# EasyEDA Pro project 4090_Portable_Fan.epro, board PCB1_2
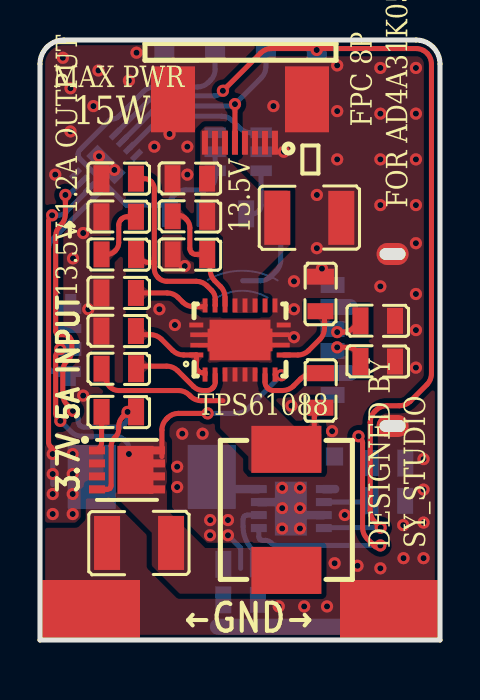
[diagram p8: board, top side]
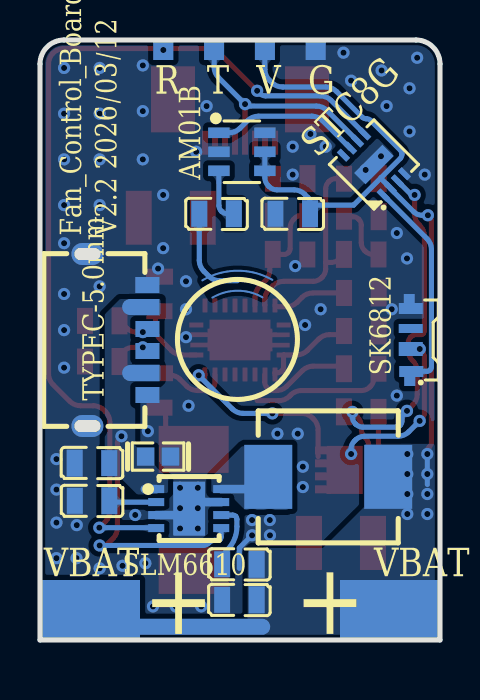
[diagram p9: board, bottom side, seen from below]

Outline 20 x 30 mm; copper layers: Top Layer, Bottom Layer. Coordinates in mm from the lower left corner of the outline.
Outline path: 0,28.8 arc(0.35,29.65) 1.2,30 18.8,30 arc(19.65,29.65) 20,28.8 20,0 0,0 0,28.8
Stack: Top Layer 0.035mm / Dielectric1 1.51mm FR4 er 4.5 / Bottom Layer 0.035mm

## Design rules (mm)
spacing copperThickness1oz (default): track to track 0.102, other pairs 0.152 to 0.3
spacing copperThickness2oz: track to track 0.203, other pairs 0.152 to 0.3
spacing Plane_innerPlane: track to track 0.102, other pairs 0.152 to 0.3
spacing Copper_copperRegion: track to track 0.102, other pairs 0.152 to 0.3
track width copperThickness1oz (default): min 0.127, default 0.254, max 2.54
track width copperThickness2oz: min 0.203, default 0.254, max 2.54
differential pair differentialPair (default): width min 0.127, default 0.254, max 2.54; gap min 0.152, default 0.152
net GND uses copperRegion_copperThickness1oz
net VBUS uses copperRegion_copperThickness1oz
net VPOWER uses copperRegion_copperThickness1oz
net VBAT uses copperRegion_copperThickness1oz
net 13.5V uses copperRegion_copperThickness1oz
net $1N43227 uses copperRegion_copperThickness1oz
net $1N43239 uses copperRegion_copperThickness1oz
pour e179 uses Copper_copperRegion, copperRegion_Copper_copperRegion
pour e222 uses Copper_copperRegion, copperRegion_Copper_copperRegion
pour e226 uses Copper_copperRegion, copperRegion_Copper_copperRegion

## Placement (name value [footprint] x y rotation side)
C1  100nF  [0805_S]  7.37 21.36 90 bottom
C2  22pF  [0805_S]  3.94 23.02 270 top
C3  330pF  [0805_S]  3.94 21.11 270 top
C4  2.2uF  [0805_S]  3.94 15.39 270 top
C5  100uF  [C1210]  4.95 4.85 0 top
C6  100nF  [0805_S]  13.97 12.47 180 top
C7  100uF  [C1210]  13.46 21.11 180 top
C8  22uF  [0805_S]  7.49 23.02 270 top
C9  22uF  [0805_S]  17.4 8.79 270 bottom
C10  22uF  [0805_S]  10.03 2.06 90 bottom
C11  100nF  [0805_S]  13.97 17.3 180 top
FPC1  AFC07-S08ECA-00  [FPC-SMD_P0.5-8P_LCS-SH-H2.0]  10 25.95 0 top
L1  2.2uh  [IND-SMD_L7.0-W6.6_MCW-0650-220]  12.32 6.5 90 top
L2  2.2uH  [IND-SMD_L7.0-W6.6]  5.59 8.16 180 bottom
LED1  SK6812SIDE-A  [LED-SMD_4P-L4.0-W1.6-L]  1.45 15 90 bottom
NOREF  -  [Pad_e184]  2.5 1.5 0 top
NOREF#2  -  [Pad_e85]  6.22 29.5 180 top
NOREF#3  -  [Pad_e88]  13.84 29.5 180 top
NOREF#4  -  [Pad_e86]  8.75 29.5 180 top
NOREF#5  -  [Pad_e189]  17.5 1.5 0 top
NOREF#6  -  [Pad_e185]  17.5 1.5 0 top
NOREF#7  -  [Pad_e87]  11.29 29.5 180 top
NOREF#8  -  [Pad_e186]  2.5 1.5 0 top
Q1  AON7421  [DFN-8_L3.0-W3.0-P0.65-BL]  4.35 8.51 270 top
R1  10K  [0805_S]  3.94 11.46 90 top
R2  10K  [0805_S]  11.18 21.36 90 bottom
R3  60.4K  [0805_S]  3.94 19.33 90 top
R4  866K  [0805_S]  7.49 21.24 90 top
R5  91K  [0805_S]  7.49 19.33 90 top
R6  169K  [0805_S]  3.94 13.62 90 top
R7  60.4K  [0805_S]  3.94 17.3 270 top
R8  240  [0805_S]  17.4 7.01 90 bottom
R9  5.1K  [0805_S]  16.89 15.9 270 top
R10  5.1K  [0805_S]  10.03 3.84 90 bottom
R11  5.1K  [0805_S]  16.89 13.87 270 top
TVS1  PESD0603-240  [D0603-BI]  14.1 9.17 0 bottom
U1  STC8G1K08A-36I-DFN8  [DFN-8_L3.0-W3.0-P0.50-BL-EP]  3.3 23.78 135 bottom
U2  -  [F9-10-6-0.4喇叭口无针触摸弹簧]  10 15 179.6 bottom
U3  TPS61088RHLR  [VQFN-20_L4.6-W3.6-P0.50-BL]  10 15 0 top
U4  -  [DFN-8_L3.0-W3.0-P0.65-BL-EP_AOZ6662DI]  12.89 6.92 180 bottom
U5  AM01B  [SOT-23-6_L2.9-W1.6-P0.95-LS2.8-BL]  9.91 24.41 270 bottom
USBC1  TYPE-C 6P WTL5.0 108  [USB-C-SMD_TYPE-C-6P-WTL5.0-108]  16.13 15 270 bottom

## Footprints (pads in the part's own frame, mm; a bottom-side part is the same pattern mirrored in y, then rotated)
0805_S
  rect 1.3x0.8 smd: 1(-0.052,0.86)
  rect 1.35x0.8 smd: 2(-0.052,-0.867)
C1210
  rect 1.3x2.7 smd: 1(-1.6,0) 2(1.6,0)
D0603-BI
  rect 0.873x0.907 smd: 1(-0.622,0) 2(0.622,0)
DFN-8_L3.0-W3.0-P0.50-BL-EP
  rect 0.28x0.665 smd: 1(-0.75,-1.407) 2(-0.25,-1.407) 3(0.25,-1.407) 4(0.75,-1.407) 5(0.75,1.407) 6(0.25,1.407) 7(-0.25,1.407) 8(-0.75,1.407)
  rect 2x0.8 smd: 9(0,0)
DFN-8_L3.0-W3.0-P0.65-BL
  rect 0.4x0.8 smd: 1(-0.975,-1.5) 2(-0.325,-1.5) 3(0.325,-1.5) 4(0.975,-1.5) 5(0.975,1.5) 6(0.325,1.5) 7(-0.325,1.5) 8(-0.975,1.5)
  rect 2.4x1.8 smd: 9(0,0.425)
DFN-8_L3.0-W3.0-P0.65-BL-EP_AOZ6662DI
  rect 0.8x0.4 smd: 1(-1.3,0.622) 2(-1.3,-0.028) 3(-1.3,-0.678) 4(-1.3,-1.328) 5(1.95,-1.328) 6(1.95,-0.678) 7(1.95,-0.028) 8(1.95,0.622)
  rect 1.6x2.7 smd: 9(0.347,-0.353)
F9-10-6-0.4喇叭口无针触摸弹簧
  custom 3.5x1.335 smd: 1(-0.111,2.965)
FPC-SMD_P0.5-8P_LCS-SH-H2.0
  rect 0.3x1.2 smd: 1(1.748,-1.084) 2(1.248,-1.084) 3(0.748,-1.084) 4(0.248,-1.084) 5(-0.252,-1.084) 6(-0.752,-1.084) 7(-1.252,-1.084) 8(-1.754,-1.083)
  rect 2.2x3.3 smd: 9(3.35,1.084) 10(-3.35,1.084)
IND-SMD_L7.0-W6.6
  rect 2.4x3.2 smd: 1(-3,0) 2(3,0)
IND-SMD_L7.0-W6.6_MCW-0650-220
  rect 2.35x3.5 smd: 1(-3.025,0) 2(3.025,0)
LED-SMD_4P-L4.0-W1.6-L
  custom 1x1.2 smd: 1(-1.8,-0.013) 4(1.8,0.013)
  custom 0.7x1.2 smd: 2(-0.45,0.013)
  custom 0.45x1.2 smd: 3(0.575,0.013)
Pad_e85
  rect 1x1 smd far side: 2(0,0)
Pad_e86
  rect 1x1 smd far side: 2(0,0)
Pad_e87
  rect 1x1 smd far side: 2(0,0)
Pad_e88
  rect 1x1 smd far side: 2(0,0)
Pad_e184
  rect 5x3 smd: 22(0,0)
Pad_e185
  rect 5x3 smd: 22(0,0)
Pad_e186
  rect 5x3 smd far side: 22(0,0)
Pad_e189
  rect 5x3 smd far side: 22(0,0)
SOT-23-6_L2.9-W1.6-P0.95-LS2.8-BL
  rect 0.532x1.072 smd: 1(-0.95,-1.149) 2(0,-1.149) 3(0.95,-1.149) 4(0.95,1.149) 5(0,1.149) 6(-0.95,1.149)
USB-C-SMD_TYPE-C-6P-WTL5.0-108
  oval 1.1x1.6 hole 0.6x1.3: 7(-4.3,-1.5) 8(4.3,-1.5)
  rect 0.8x1.2 smd: A5(-0.55,1.5) A9(1.65,1.5) A12(2.75,1.5) B5(0.55,1.5) B9(-1.65,1.5) B12(-2.75,1.5)
VQFN-20_L4.6-W3.6-P0.50-BL
  rect 0.7x0.244 smd: 1(-2.185,-0.75) 10(2.185,-0.75) 11(2.185,0.75) 20(-2.185,0.75)
  rect 0.244x0.7 smd: 2(-1.748,-1.727) 3(-1.248,-1.727) 4(-0.748,-1.727) 5(-0.248,-1.727) 6(0.252,-1.727) 7(0.752,-1.727) 8(1.252,-1.727) 9(1.752,-1.727) 12(1.752,1.727) 13(1.252,1.727) 14(0.752,1.727) 15(0.252,1.727) 16(-0.248,1.727) 17(-0.748,1.727) 18(-1.248,1.727) 19(-1.748,1.727)
  custom 4.97x2.032 smd: 21(0,0.001)

## Nets
As in the schematic, except:
GND: C1.1 C2.2 C3.2 C4.2 C5.1 C7.1 C8.2 C9.2 C10.1 C11.2 FPC1.1 FPC1.2 FPC1.3 FPC1.4 FPC1.9 FPC1.10 LED1.4 NOREF.22 NOREF#2.2 NOREF#6.22 R5.1 R7.2 R8.1 R9.1 R11.1 TVS1.1 U1.4 U1.9 U3.11 U3.12 U3.20 U3.21 U4.3 U4.7 U4.9 U5.2 U5.6 USBC1.7 USBC1.8 USBC1.A12 USBC1.B12
VBAT: C1.2 C10.2 L2.2 NOREF#4.2 NOREF#5.22 NOREF#8.22 Q1.1 Q1.2 Q1.3 R1.1 R10.2 U1.2 U5.4 U5.5
CHRG: NOREF#3.2 U1.5 U4.4
PWM: FPC1.5 NOREF#7.2 U1.6

Pads without a net: LED1 3; U1 8; U3 13

## Via types
v1: diameter 0.61, hole 0.305, Top Layer to Bottom Layer, 99 vias

## Routing (per net, layer and track width the routed paths; a pad name or vN(x,y) marks a point on that pad's centre or on a via; arc(x,y) is an arc through that point)
GND: length 5.4
  Bottom Layer w0.254: 10.03,3.58 10.03,4.6 v1(9.4,5.23)
  Bottom Layer w0.431: U4.3 13.07,6.25 arc(12.88,6.28) 12.72,6.39 12.36,6.75 arc(12.2,6.86) 12.01,6.89 U4.7
  vias: v1(0.76,23.27) v1(1.14,29.11) v1(1.52,27.59) v1(1.52,25.43) v1(1.65,19.08) v1(2.16,20.35) v1(2.16,12.22) v1(2.41,16.54) v1(2.67,26.69) v1(2.92,28.48) v1(2.95,24.19) v1(3.72,23.5) v1(4.44,27.97) v1(4.83,29.36) v1(5.72,24.67) v1(5.97,16.54) v1(6.48,25.3) v1(6.75,15.75) v1(6.86,8.66) v1(6.86,7.65) v1(7.11,10.31) v1(7.24,18.7) v1(7.37,24.67) v1(7.37,23.27) v1(8.13,10.31) v1(8.51,6) v1(8.5,5.23) v1(9.4,6) v1(11.67,26.69) v1(11.94,1.68) v1(12.11,7.61) v1(12.11,6.59) v1(12.11,5.58) v1(12.19,24.41) v1(12.57,11.71) v1(12.7,17.94) v1(12.7,16.54) v1(12.7,15.14) v1(13,7.61) v1(13,6.59) v1(13,5.58) v1(13.21,1.68) v1(13.84,22.25) v1(13.84,19.59) v1(14.1,18.57) v1(14.35,1.68) v1(14.6,10.44) v1(14.73,3.84) v1(14.86,28.73) v1(14.86,26.44) v1(14.86,24.03) v1(15.24,6.25) v1(15.88,3.71) v1(17.02,28.6) v1(17.02,26.32) v1(17.02,24.03) v1(17.02,21.75) v1(17.02,17.68) v1(17.02,3.58) v1(18.16,5.74) v1(18.18,4.09) v1(18.8,28.6) v1(18.8,26.32) v1(18.8,24.03) v1(18.8,21.75) v1(18.8,19.84) v1(18.8,17.3) v1(18.8,15.5) v1(18.8,13.62) v1(19.18,9.05) v1(19.18,7.52) v1(19.18,5.87) v1(19.18,4.09)
VBAT: length 47.8
  Top Layer w0.254: v1(0.6,21.24) 0.51,21.14 arc(0.45,21.05) 0.43,20.95 0.43,9.89 arc(0.45,9.77) 0.52,9.67 0.55,9.63 arc(0.61,9.54) 0.63,9.44 v1(0.63,9.3) ; R1.1 3.08,9.85 arc(3.05,9.72) 2.97,9.61 Q1.1
  Bottom Layer w0.254: NOREF#4.2 8.75,28.53 arc(8.7,28.24) 8.53,27.99 8.41,27.87 arc(8.17,27.71) 7.88,27.65 5.71,27.65 arc(5.42,27.59) 5.17,27.43 3.89,26.14 arc(3.8,26.08) 3.7,26.06 3.67,26.06 arc(3.56,26.04) 3.47,25.98 1.99,24.49 arc(1.93,24.4) 1.91,24.3 1.91,24.27 arc(1.93,24.17) 1.99,24.08 2.95,23.11 ; 6.5,21.72 6.5,21.88 arc(6.52,22.01) 6.6,22.12 6.77,22.29 arc(7.01,22.45) 7.29,22.51 8.14,22.51 arc(8.36,22.55) 8.55,22.68 8.59,22.71 arc(8.71,22.9) 8.76,23.12 U5.4 U5.5 ; 6.5,21.72 C1.2 ; 6.5,21.72 6.48,21.75 4.32,21.75 2.95,23.11 ; v1(0.6,21.24) 0.9,21.24 arc(1.12,21.28) 1.31,21.41 2.48,22.58 ; U1.2 2.95,23.07 2.95,23.11 ; 0.63,7.78 v1(0.63,8.3) v1(0.63,9.3)
  Bottom Layer w0.8: 8.89,0.66 16,0.66 ; NOREF#5.22 17.04,1.04 arc(16.62,0.76) 16.13,0.66 16,0.79
  vias: v1(0.63,7.3) v1(0.63,6.3) v1(1.63,9.3) v1(1.63,8.3) v1(1.63,7.3) v1(1.63,6.3)
VBUS: length 15.2
  Top Layer w0.254: v1(17.02,4.73) 16.94,4.65 16.85,4.65 arc(16.78,4.66) 16.72,4.7 16.35,5.08 arc(16.19,5.32) 16.13,5.61 16.13,9.86 arc(16.11,9.98) 16.04,10.08 v1(15.93,10.19)
  Bottom Layer w0.254: U4.5 10.94,5.16 arc(10.95,5.1) 10.99,5.04 11,5.03 arc(11.05,4.99) 11.12,4.98 11.27,4.98 arc(11.42,4.95) 11.54,4.87 11.57,4.84 arc(11.7,4.76) 11.85,4.73 16.7,4.73 16.78,4.65 16.94,4.65 v1(17.02,4.73)
  Bottom Layer w0.431: U4.1 14.76,7.55
  Bottom Layer w0.8: USBC1.A9 15.49,13.35 ; USBC1.B9 15.49,16.65
CHRG: length 46
  Top Layer w0.254: v1(17.03,5.62) 16.73,5.92 arc(16.57,6.17) 16.51,6.46 16.51,10.89 arc(16.57,11.18) 16.73,11.43 16.79,11.49 arc(17.04,11.65) 17.33,11.71 17.97,11.71 arc(18.26,11.77) 18.51,11.94 19.35,12.77 arc(19.52,13.02) 19.57,13.31 19.57,28.8 arc(19.52,29.08) 19.38,29.32 arc(19.28,29.4) 19.17,29.48 arc(19.01,29.54) 18.84,29.57 11.57,29.57 arc(11.28,29.51) 11.03,29.35 v1(9.14,27.46)
  Bottom Layer w0.254: v1(9.14,27.46) 9,27.32 arc(8.88,27.24) 8.73,27.21 5.99,27.21 arc(5.69,27.15) 5.45,26.98 3.77,25.3 ; v1(17.03,5.62) 14.21,5.62 U4.4
  vias: v1(13.84,29.5)
COMP: length 10.4
  Top Layer w0.254: 4.8,23.07 5.21,23.07 arc(5.39,23.03) 5.55,22.93 5.58,22.9 arc(5.68,22.75) 5.72,22.57 5.72,18.88 ; 5.72,18.88 5.44,18.88 arc(5.22,18.92) 5.05,19.04 R3.2 ; 5.72,18.88 5.72,18.56 arc(5.76,18.33) 5.89,18.14 5.92,18.11 arc(6.11,17.98) 6.34,17.94 7.81,17.94 arc(8.1,17.88) 8.35,17.71 8.58,17.48 arc(8.72,17.28) 8.76,17.05 8.76,16.74 8.75,16.73
FB: length 6.1
  Top Layer w0.254: 9.25,16.73 9.25,17.13 arc(9.19,17.42) 9.03,17.67 8.73,17.97 arc(8.57,18.21) 8.51,18.5 8.51,19.04 arc(8.49,19.12) 8.44,19.2 8.43,19.21 arc(8.35,19.26) 8.27,19.28 7.79,19.28 arc(7.68,19.3) 7.59,19.36 7.57,19.38 arc(7.51,19.47) 7.49,19.57 7.49,20.61 arc(7.45,20.84) 7.32,21.03 7.25,21.1 arc(7.1,21.2) 6.92,21.24 6.69,21.24 R4.1
KEY_INT0: length 7.5
  Bottom Layer w0.254: U5.1 10.54,25.36 arc(10.25,25.42) 10,25.58 9.62,25.97 arc(9.37,26.13) 9.08,26.19 6.41,26.19 arc(6.12,26.13) 5.87,25.97 4.5,24.6 U1.7
POWER_CTRL: length 21.5
  Top Layer w0.254: v1(4.38,11.41) 4.14,11.16 arc(3.99,10.94) 3.94,10.68 3.94,10.56 arc(3.89,10.33) 3.77,10.14 3.73,10.11 arc(3.6,9.92) 3.56,9.69 3.56,7.72 arc(3.54,7.65) 3.5,7.6 3.49,7.58 arc(3.43,7.54) 3.36,7.53 Q1.4 ; v1(1.65,11.46) 1.36,11.75 arc(1.2,11.99) 1.14,12.29 1.14,13.45 arc(1.19,13.72) 1.34,13.94 1.39,13.99 arc(1.54,14.22) 1.59,14.49 1.59,14.85 arc(1.57,15) 1.48,15.13 1.46,15.15 arc(1.33,15.24) 1.18,15.27 0.96,15.27 arc(0.89,15.28) 0.84,15.32 0.83,15.33 arc(0.8,15.38) 0.78,15.44 0.78,20.19 arc(0.84,20.47) 1,20.72 1.05,20.76 arc(1.21,21.01) 1.27,21.29 v1(1.27,22.25)
  Bottom Layer w0.254: v1(1.27,22.25) 1.35,22.25 arc(1.42,22.27) 1.47,22.3 U1.3 ; v1(1.65,11.46) 1.79,11.32 arc(1.88,11.19) 1.91,11.04 1.91,10.94 arc(1.93,10.83) 1.99,10.74 2,10.72 arc(2.09,10.66) 2.2,10.64 3.86,10.64 arc(4.05,10.68) 4.21,10.78 4.24,10.82 arc(4.34,10.97) 4.38,11.16 v1(4.38,11.41)
PWM: length 11.6
  Top Layer w0.254: v1(9.75,26.79) FPC1.5
  Bottom Layer w0.254: NOREF#7.2 11.29,28.66 arc(11.24,28.37) 11.07,28.12 v1(9.75,26.79) 9.69,26.74 arc(9.65,26.71) 9.59,26.7 6.19,26.7 arc(5.89,26.64) 5.65,26.47 4.12,24.95
VPOWER: length 17.1
  Top Layer w0.254: v1(12.06,13.24) 12.03,13.27 U3.9 ; v1(1.01,14.55) 0.89,14.42 arc(0.81,14.31) 0.78,14.18 0.78,11.34 arc(0.81,11.2) 0.89,11.08 v1(1.02,10.96) ; v1(8.38,11.33) 6.92,11.33 arc(6.63,11.27) 6.38,11.11 6.32,11.05 arc(6.15,10.8) 6.1,10.51 6.1,9.17
  Bottom Layer w0.254: v1(1.02,10.96) 1.56,10.41 arc(1.81,10.25) 2.1,10.19 3.78,10.19 arc(4.02,10.14) 4.22,10 4.29,9.93 arc(4.41,9.76) 4.44,9.56 v1(4.44,9.3) ; v1(8.38,11.33) 9.84,11.33 arc(10.14,11.39) 10.38,11.55 11.98,13.16 arc(12.07,13.22) 12.18,13.24 v1(12.06,13.24)
WS2812_SPI: length 10.8
  Bottom Layer w0.254: 2.84,22.25 0.65,20.06 arc(0.49,19.82) 0.43,19.53 0.43,13.66 arc(0.44,13.58) 0.49,13.51 0.5,13.5 arc(0.57,13.45) 0.65,13.43 1.05,13.43 arc(1.19,13.41) 1.31,13.33 LED1.1
$1N19622: length 1.4
  Top Layer w0.254: v1(14.86,15.39) 15.19,15.39 arc(15.44,15.45) 15.66,15.59 R9.2
$1N19624: length 1.6
  Top Layer w0.254: R11.2 16.02,14.09 arc(16,14.22) 15.93,14.33 15.8,14.45 arc(15.6,14.59) 15.36,14.63 v1(14.86,14.63)
$1N43193: length 3.2
  Top Layer w0.254: 4.8,21.16 4.35,21.16 arc(4.2,21.13) 4.08,21.05 4.05,21.02 arc(3.97,20.9) 3.94,20.75 3.94,19.87 arc(3.9,19.66) 3.78,19.48 3.74,19.44 arc(3.56,19.32) 3.35,19.28 R3.1
$1N43198: length 2.7
  Bottom Layer w0.254: U5.3 11.06,21.73 arc(11.03,21.58) 10.94,21.45 10.92,21.43 arc(10.79,21.34) 10.64,21.31 R2.2
$1N43227: length 10.2
  Top Layer w0.254: 3.08,13.69 3.2,13.57 arc(3.28,13.46) 3.3,13.32 3.3,13.1 arc(3.35,12.87) 3.47,12.68 3.51,12.65 arc(3.7,12.52) 3.93,12.47 6.92,12.47 arc(7.21,12.42) 7.46,12.25 7.52,12.19 arc(7.77,12.02) 8.06,11.97 9.14,11.97 ; L1.2 12.87,9.53 arc(13.16,9.59) 13.41,9.75 13.49,9.84 arc(13.66,10.09) 13.72,10.38 13.72,11.11 arc(13.75,11.29) 13.85,11.45 C6.1
$1N43235: length 3.7
  Bottom Layer w0.254: 10.86,3.4 10.86,3.97 arc(10.8,4.26) 10.64,4.5 arc(10.28,5.04) 10.15,5.67 10.15,6.05 arc(10.17,6.12) 10.21,6.18 10.22,6.19 arc(10.28,6.23) 10.35,6.25 U4.6
$1N43239: length 2.6
  Bottom Layer w0.431: U4.8 9.59,7.55 arc(9.23,7.62) 8.92,7.82 L2.1
$1N43243: length 2.4
  Bottom Layer w0.254: R8.2 16.47,6.89 U4.2
$1N43246: length 4.7
  Top Layer w0.254: U3.2 8.25,13.36 8.11,13.36 arc(8.01,13.38) 7.92,13.44 7.9,13.46 arc(7.84,13.55) 7.82,13.66 7.82,14.24 U3.1 7.81,14.25 7.17,14.25 arc(6.88,14.31) 6.63,14.47 6.06,15.05 arc(5.82,15.21) 5.53,15.27 5.09,15.27 arc(4.98,15.29) 4.9,15.35 4.8,15.45
$1N43249: length 5
  Top Layer w0.254: 8.76,13.27 8.76,12.89 arc(8.73,12.74) 8.65,12.61 8.62,12.59 arc(8.5,12.5) 8.35,12.47 8.16,12.47 arc(7.9,12.53) 7.67,12.68 6.88,13.47 arc(6.63,13.63) 6.34,13.69 4.8,13.69
$1N43260: length 3.7
  Top Layer w0.254: 4.8,17.35 6.36,17.35 arc(6.65,17.29) 6.9,17.13 7.14,16.89 arc(7.39,16.72) 7.68,16.67 8.19,16.67 8.25,16.73
$1N43262: length 3.4
  Top Layer w0.254: U3.8 11.25,12.89 arc(11.28,12.74) 11.37,12.61 11.39,12.59 arc(11.52,12.5) 11.67,12.47 12.13,12.47 arc(12.42,12.53) 12.67,12.7 13.02,13.05 arc(13.23,13.19) 13.47,13.24 13.79,13.24
$1N43264: length 3.6
  Top Layer w0.254: U3.10 12.89,14.25 arc(13.18,14.31) 13.43,14.47 14,15.05 arc(14.17,15.29) 14.22,15.58 14.22,16.11 arc(14.2,16.23) 14.13,16.33 C11.1
$1N43270: length 4.8
  Bottom Layer w0.254: R2.1 12.04,18.98 arc(11.98,18.69) 11.81,18.44 11.56,18.19 arc(11.31,18.02) 11.02,17.96 U2.1

## Copper pours and planes (outline as drawn; the poured copper is in the pictures)
13.5V on Top Layer: 9.15,16.35 9.15,20.14 8.94,20.35 8.22,20.35 8.01,20.56 8.01,25.44 8.25,25.68 9.15,25.68 9.44,25.4 9.44,23.99 10.94,22.49 12.38,22.49 12.51,22.36 12.51,19.76 10.92,18.17 10.92,16.35
GND on Top Layer: 0,30 20,30 20,0 0,0
GND on Top Layer: 9.02,8.16 14.73,8.16 14.73,4.85 9.02,4.85
GND on Bottom Layer: 0,30 20,30 20,0 0,0
VBAT on Top Layer: 0,9.76 3.1,9.76 3.3,9.55 3.3,8.03 3,7.73 2.23,7.73 2.03,7.53 2.03,6.12 1.78,5.87 0,5.87 0,5.87
VBAT on Bottom Layer: 9.62,0.25 2.44,0.25 1.4,1.3 1.4,9.81 3.79,9.81 3.79,6.66 5.85,4.6 9.4,4.6 9.62,4.38
VBAT on Bottom Layer: 0,9.81 2.04,9.81 2.04,2.57 0,2.57
VBUS on Bottom Layer: 13.97,17.05 16,17.05 16.76,16.28 16.76,8.28 16.64,8.16 16.02,8.16 15.13,7.27 13.72,7.27 13.59,7.39 13.59,8.07 15.24,9.72 15.24,12.88 14.07,12.88 13.97,12.98 13.97,13.74 14.03,13.8 15.4,13.8 15.4,16 15.37,16.03 14.1,16.03 13.97,16.16
VPOWER on Top Layer: 3.83,9.94 6.35,9.94 6.35,6.51 8.25,4.6 14.06,4.6 14.06,2.41 13.97,2.31 6.99,2.31 5.59,3.71 5.59,5.36 3.68,7.27 3.68,9.79
$1N43227 on Top Layer: 9,13.65 10.89,13.65 10.92,13.62 10.92,12.47 12.7,10.7 13.97,10.7 14.1,10.57 14.1,8.41 13.97,8.28 10.67,8.28 10.41,8.54 10.41,9.17 9,10.58
$1N43239 on Bottom Layer: 9.9,9.69 11.43,8.16 11.43,7.39 11.18,7.14 10.39,7.14 9.76,6.5 7.64,6.5 7.49,6.66 7.49,9.69

Small or netless copper shapes (teardrops, artwork), in the pictures only: 37 on Top Layer, 33 on Bottom Layer

## Text on the board
Bottom Silkscreen Layer: SK6812 | AM01B | Fan_Control_Board / V2.2 2026/03/12 | TYPEC-5.0mm | SLM6610 | STC8G | VBAT | G | V | T | R | +
Top Silkscreen Layer: MAX PWR | TPS61088 | 13.5V 1.2A OUTPUT | 3.7V 5A INPUT    → | 13.5V | FPC 8P | FOR AD4A31K05 | DESIGNED BY / SY_STUDIO | 15W | ←GND→ | ①
